# Altium schematic sheet title.SchDoc: Title
size A3; Organization: Institut d'Automatisation Industrielle; SVN: OUI; ProjectName: <projet>
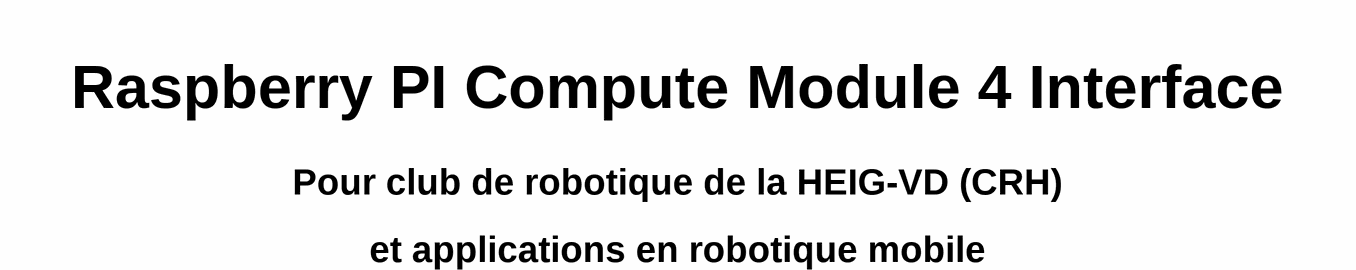
[diagram p0: title.SchDoc]

## Notes on the sheet
- Raspberry PI Compute Module 4 Interface
- Pour club de robotique de la HEIG-VD (CRH)
- et applications en robotique mobile
- HES-SO / HEIG-VD / TIN / IAI
  Route de Cheseaux, 1
  CH-1401 Yverdon-les-Bains
  T +41 24 557 73 77    F +41 24 557 63 20
  http://iai.heig-vd.ch
  iai@heig-vd.ch
- Title
- Size
- Date
- A4
- Project
- Sheet
- of
- No.
- Author
- SVN/Git
- Version
- File